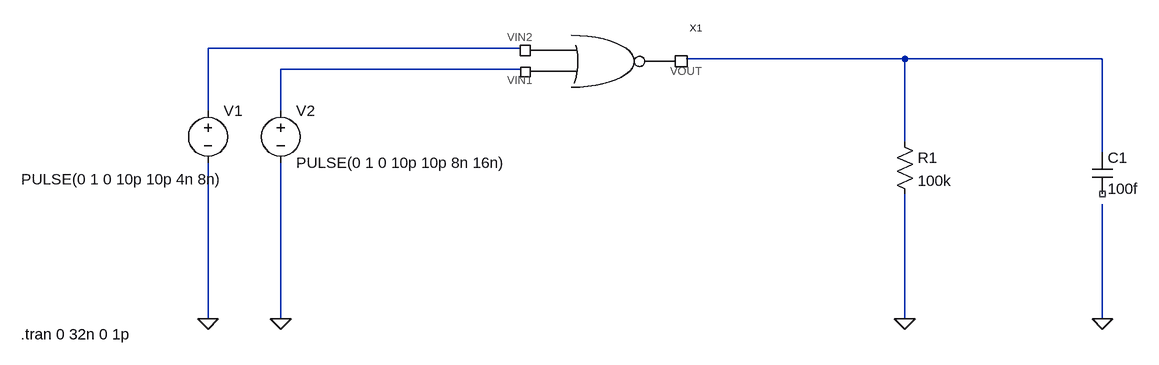
[diagram p0: schematic test_scheme_valve.asc]
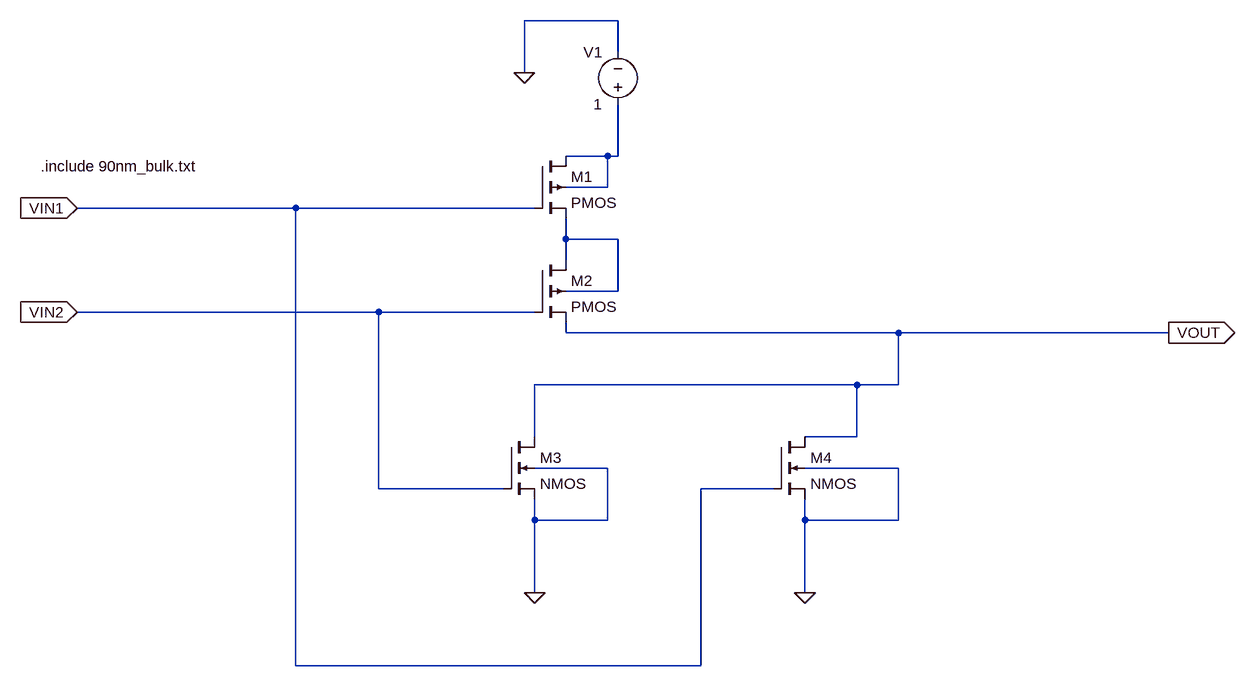
[diagram p1: sub-circuit symbol_valve.asc]
test_scheme_valve.asc, the LTspice schematic file:
Version 4
SHEET 1 1104 680
WIRE 144 208 -336 208
WIRE 736 224 400 224
WIRE 1040 224 736 224
WIRE 144 240 -224 240
WIRE -336 304 -336 208
WIRE -224 304 -224 240
WIRE 736 352 736 224
WIRE 1040 368 1040 224
WIRE -336 624 -336 384
WIRE -224 624 -224 384
WIRE 736 624 736 432
WIRE 1040 624 1040 448
FLAG -336 624 0
FLAG -224 624 0
FLAG 736 624 0
FLAG 1040 624 0
SYMBOL symbol_valve 272 288 R0
SYMATTR InstName X1
SYMBOL res 720 336 R0
SYMATTR InstName R1
SYMATTR Value 100k
SYMBOL voltage -336 288 R0
WINDOW 3 -287 121 Left 2
WINDOW 123 0 0 Left 0
WINDOW 39 0 0 Left 0
SYMATTR Value PULSE(0 1 0 10p 10p 4n 8n)
SYMATTR InstName V1
SYMBOL voltage -224 288 R0
WINDOW 123 0 0 Left 0
WINDOW 39 0 0 Left 0
SYMATTR InstName V2
SYMATTR Value PULSE(0 1 0 10p 10p 8n 16n)
SYMBOL cap 1024 368 R0
SYMATTR InstName C1
SYMATTR Value 100f
TEXT -624 648 Left 2 !.tran 0 32n 0 1p

symbol_valve.asc, the sub-circuit schematic file:
Version 4
SHEET 1 1116 900
WIRE 144 -96 0 -96
WIRE 144 -48 144 -96
WIRE 0 -16 0 -96
WIRE 128 112 64 112
WIRE 144 112 144 32
WIRE 144 112 128 112
WIRE 128 160 128 112
WIRE 128 160 64 160
WIRE -352 192 -688 192
WIRE 16 192 -352 192
WIRE 64 240 64 208
WIRE 144 240 64 240
WIRE 64 272 64 240
WIRE 144 320 144 240
WIRE 144 320 64 320
WIRE -224 352 -688 352
WIRE 16 352 -224 352
WIRE 64 384 64 368
WIRE 576 384 64 384
WIRE 992 384 576 384
WIRE 512 464 16 464
WIRE 576 464 576 384
WIRE 576 464 512 464
WIRE 16 544 16 464
WIRE 512 544 512 464
WIRE 512 544 432 544
WIRE 128 592 16 592
WIRE 576 592 432 592
WIRE -224 624 -224 352
WIRE -32 624 -224 624
WIRE 384 624 272 624
WIRE 16 672 16 640
WIRE 128 672 128 592
WIRE 128 672 16 672
WIRE 432 672 432 640
WIRE 576 672 576 592
WIRE 576 672 432 672
WIRE 16 784 16 672
WIRE 432 784 432 672
WIRE -352 896 -352 192
WIRE 272 896 272 624
WIRE 272 896 -352 896
FLAG 16 784 0
FLAG 432 784 0
FLAG 992 384 VOUT
IOPIN 992 384 Out
FLAG -688 192 VIN1
IOPIN -688 192 In
FLAG -688 352 VIN2
IOPIN -688 352 In
FLAG 0 -16 0
SYMBOL pmos4 16 112 R0
SYMATTR InstName M1
SYMATTR Value2 l=90n w=400n
SYMBOL pmos4 16 272 R0
SYMATTR InstName M2
SYMATTR Value2 l=90n w=400n
SYMBOL nmos4 -32 544 R0
SYMATTR InstName M3
SYMATTR Value2 l=90n w=200n
SYMBOL nmos4 384 544 R0
SYMATTR InstName M4
SYMATTR Value2 l=90n w=200n
SYMBOL voltage 144 48 R180
WINDOW 0 24 96 Left 2
WINDOW 3 24 16 Left 2
WINDOW 123 0 0 Left 0
WINDOW 39 0 0 Left 0
SYMATTR InstName V1
SYMATTR Value 1
TEXT -744 128 Left 2 !.include 90nm_bulk.txt

The netlist it stands for:
* test_scheme_valve.asc
XX1 N003 N001 N002 symbol_valve
R1 N002 0 100k
V1 N001 0 PULSE(0 1 0 10p 10p 4n 8n)
V2 N003 0 PULSE(0 1 0 10p 10p 8n 16n)
C1 N002 NC_01 100f

* block symbol definitions
.subckt symbol_valve VIN1 VIN2 VOUT
M1 N001 VIN1 N002 N001 PMOS l=90n w=400n
M2 N002 VIN2 VOUT N002 PMOS l=90n w=400n
M3 VOUT VIN2 0 0 NMOS l=90n w=200n
M4 VOUT VIN1 0 0 NMOS l=90n w=200n
V1 N001 0 1
.include 90nm_bulk.txt
.ends symbol_valve

.model NMOS NMOS
.model PMOS PMOS
.lib standard.mos
.tran 0 32n 0 1p
.backanno
.end